# Altium schematic sheet Interface.SchDoc
size A4
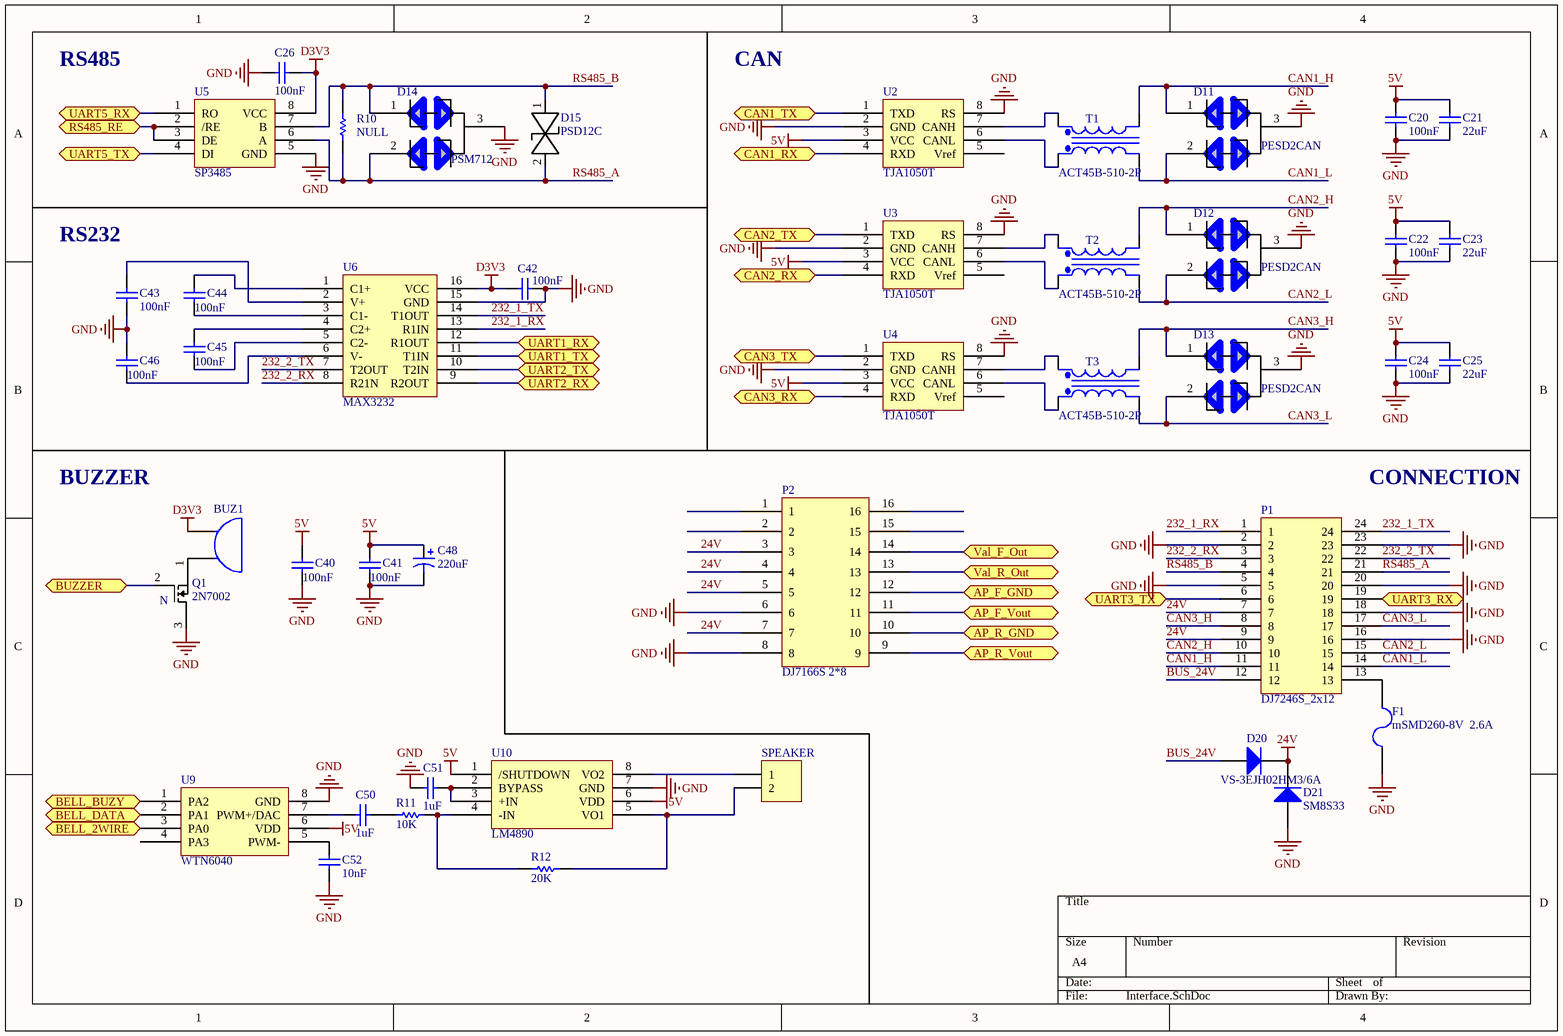
[diagram p0: Interface.SchDoc]

## Parts
BUZ1  BUZZER  [BUZ0905]  (value not drawn)
C20  100nF  [0402]
C21  22uF  [0805]
C22  100nF  [0402]
C23  22uF  [0805]
C24  100nF  [0402]
C25  22uF  [0805]
C26  100nF  [0603]
C40  100nF  [0402]
C41  100nF  [0402]
C42  100nF  [0402]
C43  100nF  [0402]
C44  100nF  [0402]
C45  100nF  [0402]
C46  100nF  [0402]
C48  220uF  [cap_pol_8*10.2]
C50  1uF  [0402]
C51  1uF  [0402]
C52  10nF  [0402]
D11  PESD2CAN  [SOT23]
D12  PESD2CAN  [SOT23]
D13  PESD2CAN  [SOT23]
D14  PSM712  [SOT23]
D15  PSD12C  [SOD323]
D20  VS-3EJH02HM3/6A  [B290]
D21  SM8S33  [SM8S]
F1  mSMD260-8V  2.6A  [1812]
P1  DJ7246S_2x12  [DJ7246S_2*12]
P2  DJ7166S 2*8  [DJ7161S_0.7_10AW]
Q1  2N7002  [2N7002]
R10  NULL  [0603]
R11  10K  [0402]
R12  20K  [0402]
SPEAKER  XH2.54-2PIN  [HDR1X2]  (value not drawn)
T1  ACT45B-510-2P  [ACT45B-510-2P]
T2  ACT45B-510-2P  [ACT45B-510-2P]
T3  ACT45B-510-2P  [ACT45B-510-2P]
U2  TJA1050T  [SO8]
U3  TJA1050T  [SO8]
U4  TJA1050T  [SO8]
U5  SP3485  [SO-8N]
U6  MAX3232  [SO16]
U9  WTN6040  [SO8]
U10  LM4890  [MSOP8]

## Ports
AP_F_GND (bidir), AP_F_Vout (bidir), AP_R_GND (bidir), AP_R_Vout (bidir), BELL_2WIRE, BELL_BUZY, BELL_DATA, BUZZER, CAN1_RX, CAN1_TX, CAN2_RX, CAN2_TX, CAN3_RX, CAN3_TX, RS485_RE, UART1_RX, UART1_TX, UART2_RX, UART2_TX, UART3_RX, UART3_TX, UART5_RX, UART5_TX, Val_F_Out (bidir), Val_R_Out (bidir)

## Nets
5V: C20.2 C21.2 C22.2 C23.2 C24.2 C25.2 C40.2 C41.2 C48.1 U2.3(VCC) U3.3(VCC) U4.3(VCC) U9.6(VDD) U10.1(/SHUTDOWN) U10.6(VDD)
24V: D20.2(K) D21.2(K) P1.7 P1.9 P2.3 P2.4 P2.5 P2.7
D3V3: BUZ1.1(A) C26.2 C42.2 U5.8(VCC) U6.16(VCC)
GND: C20.1 C21.1 C22.1 C23.1 C24.1 C25.1 C26.1 C40.1 C41.1 C42.1 C43.2 C46.2 C48.2 C51.2 C52.2 D11.3 D12.3 D13.3 D14.3 D21.1(A) F1.2 P1.2 P1.5 P1.16 P1.18 P1.20 P1.23 P2.6 P2.8 Q1.3(S) U2.2(GND) U2.8(RS) U3.2(GND) U3.8(RS) U4.2(GND) U4.8(RS) U5.5(GND) U6.15(GND) U9.8(GND) U10.7(GND)
232_1_RX: P1.1 U6.13(R1IN)
232_1_TX: P1.24 U6.14(T1OUT)
232_2_RX: P1.3 U6.8(R21N)
232_2_TX: P1.22 U6.7(T2OUT)
AP_F_GND: P2.12 ; port AP_F_GND
AP_F_Vout: P2.11 ; port AP_F_Vout
AP_R_GND: P2.10 ; port AP_R_GND
AP_R_Vout: P2.9 ; port AP_R_Vout
BELL_2WIRE: U9.3(PA0) ; port BELL_2WIRE
BELL_BUZY: U9.1(PA2) ; port BELL_BUZY
BELL_DATA: U9.2(PA1) ; port BELL_DATA
BUS_24V: D20.1(A) P1.12
BUZZER: Q1.2(G) ; port BUZZER
CAN1_H: D11.1 P1.11 T1.4(Sec-)
CAN1_L: D11.2 P1.14 T1.2(Pri-)
CAN1_RX: U2.4(RXD) ; port CAN1_RX
CAN1_TX: U2.1(TXD) ; port CAN1_TX
CAN2_H: D12.1 P1.10 T2.4(Sec-)
CAN2_L: D12.2 P1.15 T2.2(Pri-)
CAN2_RX: U3.4(RXD) ; port CAN2_RX
CAN2_TX: U3.1(TXD) ; port CAN2_TX
CAN3_H: D13.1 P1.8 T3.4(Sec-)
CAN3_L: D13.2 P1.17 T3.2(Pri-)
CAN3_RX: U4.4(RXD) ; port CAN3_RX
CAN3_TX: U4.1(TXD) ; port CAN3_TX
RS485_A: D14.2 D15.2 P1.21 R10.2 U5.6(A)
RS485_B: D14.1 D15.1 P1.4 R10.1 U5.7(B)
RS485_RE: U5.2(/RE) U5.3(DE) ; port RS485_RE
UART1_RX: U6.12(R1OUT) ; port UART1_RX
UART1_TX: U6.11(T1IN) ; port UART1_TX
UART2_RX: U6.9(R2OUT) ; port UART2_RX
UART2_TX: U6.10(T2IN) ; port UART2_TX
UART3_RX: P1.19 ; port UART3_RX
UART3_TX: P1.6 ; port UART3_TX
UART5_RX: U5.1(RO) ; port UART5_RX
UART5_TX: U5.4(DI) ; port UART5_TX
Val_F_Out: P2.14 ; port Val_F_Out
Val_R_Out: P2.13 ; port Val_R_Out
NetBUZ1_2: BUZ1.2(B) Q1.1(D)
NetC43_1: C43.1 U6.2(V+)
NetC44_1: C44.1 U6.3(C1-)
NetC44_2: C44.2 U6.1(C1+)
NetC45_1: C45.1 U6.5(C2-)
NetC45_2: C45.2 U6.4(C2+)
NetC46_1: C46.1 U6.6(V-)
NetC50_1: C50.1 R11.1
NetC50_2: C50.2 U9.7(PWM+/DAC)
NetC51_1: C51.1 U10.2(BYPASS) U10.3(+IN)
NetC52_1: C52.1 U9.5(PWM-)
NetF1_1: F1.1 P1.13
NetR11_2: R11.2 R12.1 U10.4(-IN)
NetR12_2: R12.2 SPEAKER.2 U10.5(VO1)
NetSPEAKER_1: SPEAKER.1 U10.8(VO2)
NetT1_1: T1.1(Pri+) U2.6(CANL)
NetT1_3: T1.3(Sec+) U2.7(CANH)
NetT2_1: T2.1(Pri+) U3.6(CANL)
NetT2_3: T2.3(Sec+) U3.7(CANH)
NetT3_1: T3.1(Pri+) U4.6(CANL)
NetT3_3: T3.3(Sec+) U4.7(CANH)

Not connected (* = marked no-connect by the designer): P2 1 2 15 16; U2 5(Vref); U3 5(Vref); U4 5(Vref); U9 4(PA3)

## Notes on the sheet
- RS485
- CAN
- (near C43) RS232
- BUZZER
- (near P1) CONNECTION
- (in symbol N-MOSFET) N

## Library data of the parts
C20-C26 C40-C46 = Cap: Capacitor; Published: 8-Jun-2000; Publisher: Altium Limited
  C20 C22 C24 C26 C40-C46: LatestRevisionDate: 17-Jul-2002; LatestRevisionNote: Re-released for DXP Platform.; PackageReference: RAD-0.3; PackageDescription: Radial Cap, Thru-Hole; 2 Leads; 0.3 in Pin Spacing; Value: 100nF
  C21 C23 C25: Revision: July-2002: Re-released for DXP Platform.; Value: 22uF
C48 = Cap Pol1: Polarized Capacitor (Radial); Value: 47uF; Published: 8-Jun-2000; LatestRevisionDate: 17-Jul-2002; LatestRevisionNote: Re-released for DXP Platform.; PackageReference: RB7.6-15; Publisher: Altium Limited; PackageDescription: Polarized Capacitor (Radial); 2 Leads
C50-C52 = Cap: Capacitor; Value: 100nF; Published: 8-Jun-2000; LatestRevisionDate: 17-Jul-2002; LatestRevisionNote: Re-released for DXP Platform.; PackageReference: RAD-0.3; Publisher: Altium Limited; PackageDescription: Radial Cap, Thru-Hole; 2 Leads; 0.3 in Pin Spacing
D11-D14 = PESD1CAN
D20 = Diode 1N4007: 1 Amp General Purpose Rectifier; pin to pad: 1>2 2>1; Published: 8-Jun-2000; LatestRevisionDate: 17-Jul-2002; LatestRevisionNote: Re-released for DXP Platform.; DatasheetVersion: 1998; PackageVersion: Aug-1999; PackageReference: DO-41; Publisher: Altium Limited; PackageDescription: Diode, Axial; Body 5.2 x 2.7 mm (LxDia. max), Lead Dia. 0.86 mm (max); Code_JEDEC: DO-204-AL; ComponentLink1Description: Manufacturer Link; ComponentLink1URL: http://www.fairchildsemi.com/; ComponentLink2Description: Datasheet; ComponentLink2URL: http://www.fairchildsemi.com/ds/1N%2F1N4001.pdf
D21 = Diode 1N4007: 1 Amp General Purpose Rectifier; Published: 8-Jun-2000; LatestRevisionDate: 17-Jul-2002; LatestRevisionNote: Re-released for DXP Platform.; DatasheetVersion: 1998; PackageVersion: Aug-1999; PackageReference: DO-41; Publisher: Altium Limited; PackageDescription: Diode, Axial; Body 5.2 x 2.7 mm (LxDia. max), Lead Dia. 0.86 mm (max); Code_JEDEC: DO-204-AL; ComponentLink1Description: Manufacturer Link; ComponentLink1URL: http://www.fairchildsemi.com/; ComponentLink2Description: Datasheet; ComponentLink2URL: http://www.fairchildsemi.com/ds/1N%2F1N4001.pdf
F1 = Fuse 2: Fuse; Published: 8-Jun-2000; LatestRevisionDate: 17-Jul-2002; LatestRevisionNote: Re-released for DXP Platform.; PackageReference: PIN-W2/E2.8; Publisher: Altium Limited; PackageDescription: Thru-Hole; 2 Leads
P1 = DJ7246S-0.7-10AW
P2 = DJ7166S
Q1 = N-MOSFET
R10 R11 = Res1: Resistor; Published: 8-Jun-2000; LatestRevisionDate: 17-Jul-2002; LatestRevisionNote: Re-released for DXP Platform.; PackageReference: AXIAL-0.3; Publisher: Altium Limited
  R11: PackageDescription: Axial Device, Thru-Hole; 2 Leads; 0.3 in Pin Spacing; Value: 10K
R12 = Res1: Resistor; Value: 10K; Published: 8-Jun-2000; LatestRevisionDate: 17-Jul-2002; LatestRevisionNote: Re-released for DXP Platform.; PackageReference: AXIAL-0.3; Publisher: Altium Limited; PackageDescription: Axial Device, Thru-Hole; 2 Leads; 0.3 in Pin Spacing
SPEAKER = Header 2: Header, 2-Pin; LatestRevisionDate: 17-Jul-2002; LatestRevisionNote: Re-released for DXP Platform.; Publisher: Altium Limited
T1-T3 = Trans Eq: Transformer (Equivalent Circuit Model); Published: 8-Jun-2000; LatestRevisionDate: 17-Jul-2002; LatestRevisionNote: Re-released for DXP Platform.; PackageReference: TRF_4; Publisher: Altium Limited; PackageDescription: Transformer; 4 Leads
U2-U4 = TJA1050T: CAN Tranceiver